# Altium project PCB_Project.PrjPcb
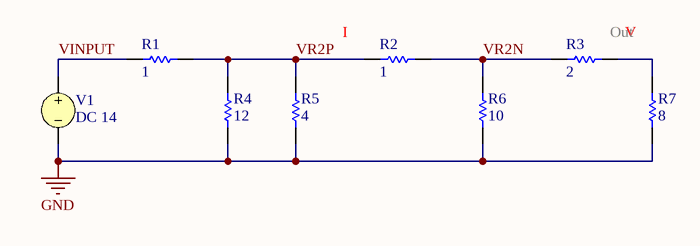
[diagram p0: Sheet1.SchDoc]
4 sheets, 29 parts. Net scope: global (net labels, ports and power ports of the same name join across sheets).
Sheets:
  Sheet1.SchDoc
  Sheet2.SchDoc
  Sheet3.SchDoc
  Sheet4.SchDoc

## Sheet Sheet1.SchDoc
size A4; SheetNumber: 1; SheetTotal: 1

### Parts
R1  value 1  (hidden comment: Resistor)
R2  value 1  (hidden comment: Resistor)
R3  value 2  (hidden comment: Resistor)
R4  value 12  (hidden comment: Resistor)
R5  value 4  (hidden comment: Resistor)
R6  value 10  (hidden comment: Resistor)
R7  value 8  (hidden comment: Resistor)
V1  DC 14

### Nets
GND: R4.1 R5.1 R6.2 R7.1 V1.2
VINPUT: R1.1 V1.1
VR2N: R2.1 R3.1 R6.1
VR2P: R1.2 R2.2 R4.2 R5.2
NetR3_2: R3.2 R7.2

### Library data of the parts
R1-R7 = Resistor: TC1: 0; SimulationGenericComponent: True; TC2: 0
V1 = VSRC: Voltage Source; Note: PCB Footprint - Not required; AC Magnitude: 1; AC Phase: 0; Value: 14; Published: 8-Jun-2000; LatestRevisionDate: 17-Jul-2002; LatestRevisionNote: Re-released for DXP Platform.; PackageReference: Not Applicable; Publisher: Altium Limited

## Sheet Sheet2.SchDoc
size A4; SheetNumber: 2; SheetTotal: 2
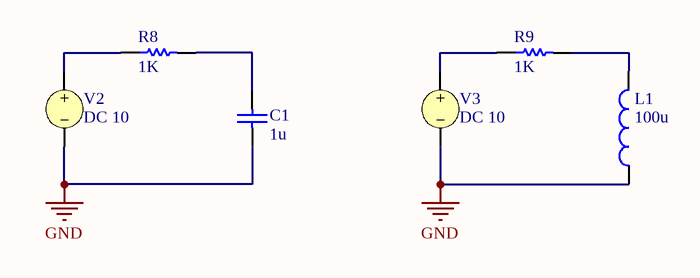
[diagram p1: Sheet2.SchDoc]

### Parts
C1  value 1u  (hidden comment: Capacitor)
L1  value 100u  (hidden comment: Inductor)
R8  value 1K  (hidden comment: Resistor)
R9  value 1K  (hidden comment: Resistor)
V2  DC 10
V3  DC 10

### Nets
GND: C1.1 L1.1 V2.2 V3.2
NetC1_2: C1.2 R8.2
NetL1_2: L1.2 R9.2
NetR8_1: R8.1 V2.1
NetR9_1: R9.1 V3.1

### Library data of the parts
C1 = Capacitor: SimulationGenericComponent: True
L1 = Inductor: SimulationGenericComponent: True
R8 R9 = Resistor: TC1: 0; SimulationGenericComponent: True; TC2: 0
V2 V3 = VSRC: Voltage Source; Note: PCB Footprint - Not required; AC Magnitude: 1; AC Phase: 0; Value: 10; Published: 8-Jun-2000; LatestRevisionDate: 17-Jul-2002; LatestRevisionNote: Re-released for DXP Platform.; PackageReference: Not Applicable; Publisher: Altium Limited

## Sheet Sheet3.SchDoc
size A4; SheetNumber: 3; SheetTotal: 3
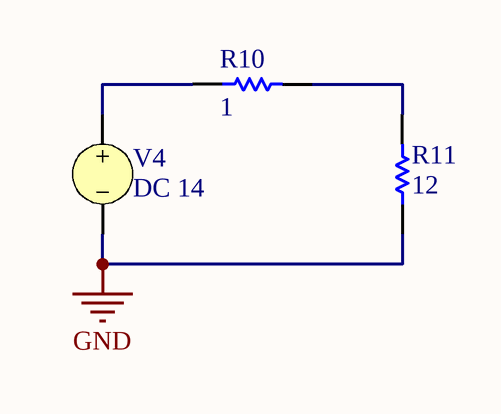
[diagram p2: Sheet3.SchDoc]

### Parts
R10  value 1  (hidden comment: Resistor)
R11  value 12  (hidden comment: Resistor)
V4  DC 14

### Nets
GND: R11.1 V4.2
NetR10_1: R10.1 V4.1
NetR10_2: R10.2 R11.2

### Library data of the parts
R10 R11 = Resistor: TC1: 0; SimulationGenericComponent: True; TC2: 0
V4 = VSRC: as V1 on sheet Sheet1; Published: 8-Jun-2000; LatestRevisionDate: 17-Jul-2002; LatestRevisionNote: Re-released for DXP Platform.; PackageReference: Not Applicable; Publisher: Altium Limited

## Sheet Sheet4.SchDoc
size A4; SheetNumber: 4; SheetTotal: 4; SPICEModelCacheVZIJWIUZ: <root> / <DocumentId>VZIJWIUZ</DocumentId> / <CacheFrame Number="0"> / <Model Name="q2n2222a" Kind="MDL"> / <Text>.model Q2N2222A NPN(Is=14.34f Xti=3 Eg=1.11 Vaf=74.03 Bf=255.9 Ne=1.307 / +		Ise=14.34f Ikf=.2847 Xtb=1.5 Br=6.092 Nc=2 Isc=0 Ikr=0 Rc=1 / +		Cjc=7.306p Mjc=.3416 Vjc=.75 Fc=.5 Cje=22.01p Mje=.377 Vje=.75 / +		Tr=46.91n Tf=411.1p Itf=.6 Vtf=1.7 Xtf=3 Rb=10)</Text> / </Model> / </CacheFrame> / </root>
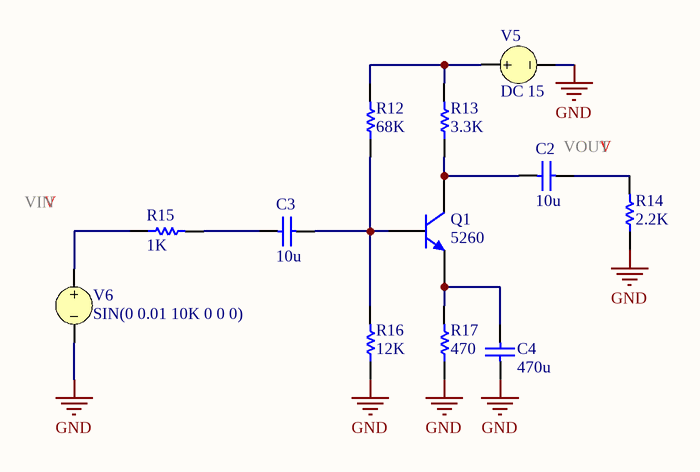
[diagram p3: Sheet4.SchDoc]

### Parts
C2  value 10u  (hidden comment: Capacitor)
C3  value 10u  (hidden comment: Capacitor)
C4  value 470u  (hidden comment: Capacitor)
Q1  Inflow: 5260  [SOT23_N]  (hidden comment: NPN)
R12  value 68K  (hidden comment: Resistor)
R13  value 3.3K  (hidden comment: Resistor)
R14  value 2.2K  (hidden comment: Resistor)
R15  value 1K  (hidden comment: Resistor)
R16  value 12K  (hidden comment: Resistor)
R17  value 470  (hidden comment: Resistor)
V5  DC 15
V6  SIN(0 0.01 10K 0 0 0)

### Nets
GND: C4.1 R14.1 R16.1 R17.1 V5.2 V6.2
NetC2_1: C2.1 R14.2
NetC2_2: C2.2 Q1.3(C) R13.1
NetC3_1: C3.1 R15.2
NetC3_2: C3.2 Q1.1(B) R12.1 R16.2
NetC4_2: C4.2 Q1.2(E) R17.2
NetR12_2: R12.2 R13.2 V5.1
NetR15_1: R15.1 V6.1

### Library data of the parts
C2-C4 = Capacitor: SimulationGenericComponent: True
Q1 = Semi_BJT_2N2222_SMD: NPN Switching Transistors; Rating: Rating?; Type: Type?; Validation: Valid; Value: NPN; Package: Package?
R12-R17 = Resistor: TC1: 0; SimulationGenericComponent: True; TC2: 0
V5 = VSRC: Voltage Source; Note: PCB Footprint - Not required; AC Magnitude: 1; AC Phase: 0; Value: 15; Published: 8-Jun-2000; LatestRevisionDate: 17-Jul-2002; LatestRevisionNote: Re-released for DXP Platform.; PackageReference: Not Applicable; Publisher: Altium Limited
V6 = VSRC: Voltage Source; Note: PCB Footprint - Not required; AC Magnitude: 1; AC Phase: 0; DC Magnitude: 5; Amplitude: 0.01; Published: 8-Jun-2000; LatestRevisionDate: 17-Jul-2002; LatestRevisionNote: Re-released for DXP Platform.; PackageReference: Not Applicable; Publisher: Altium Limited; Offset: 0; Frequency: 10K; Delay: 0; Damping Factor: 0; Phase: 0

## Nets that join several sheets
GND: Sheet1 (5 pins), Sheet2 (C1.1 L1.1 V2.2 V3.2), Sheet3 (R11.1 V4.2), Sheet4 (6 pins)